# Altium project Проект_ЕТЗ.PrjPcb
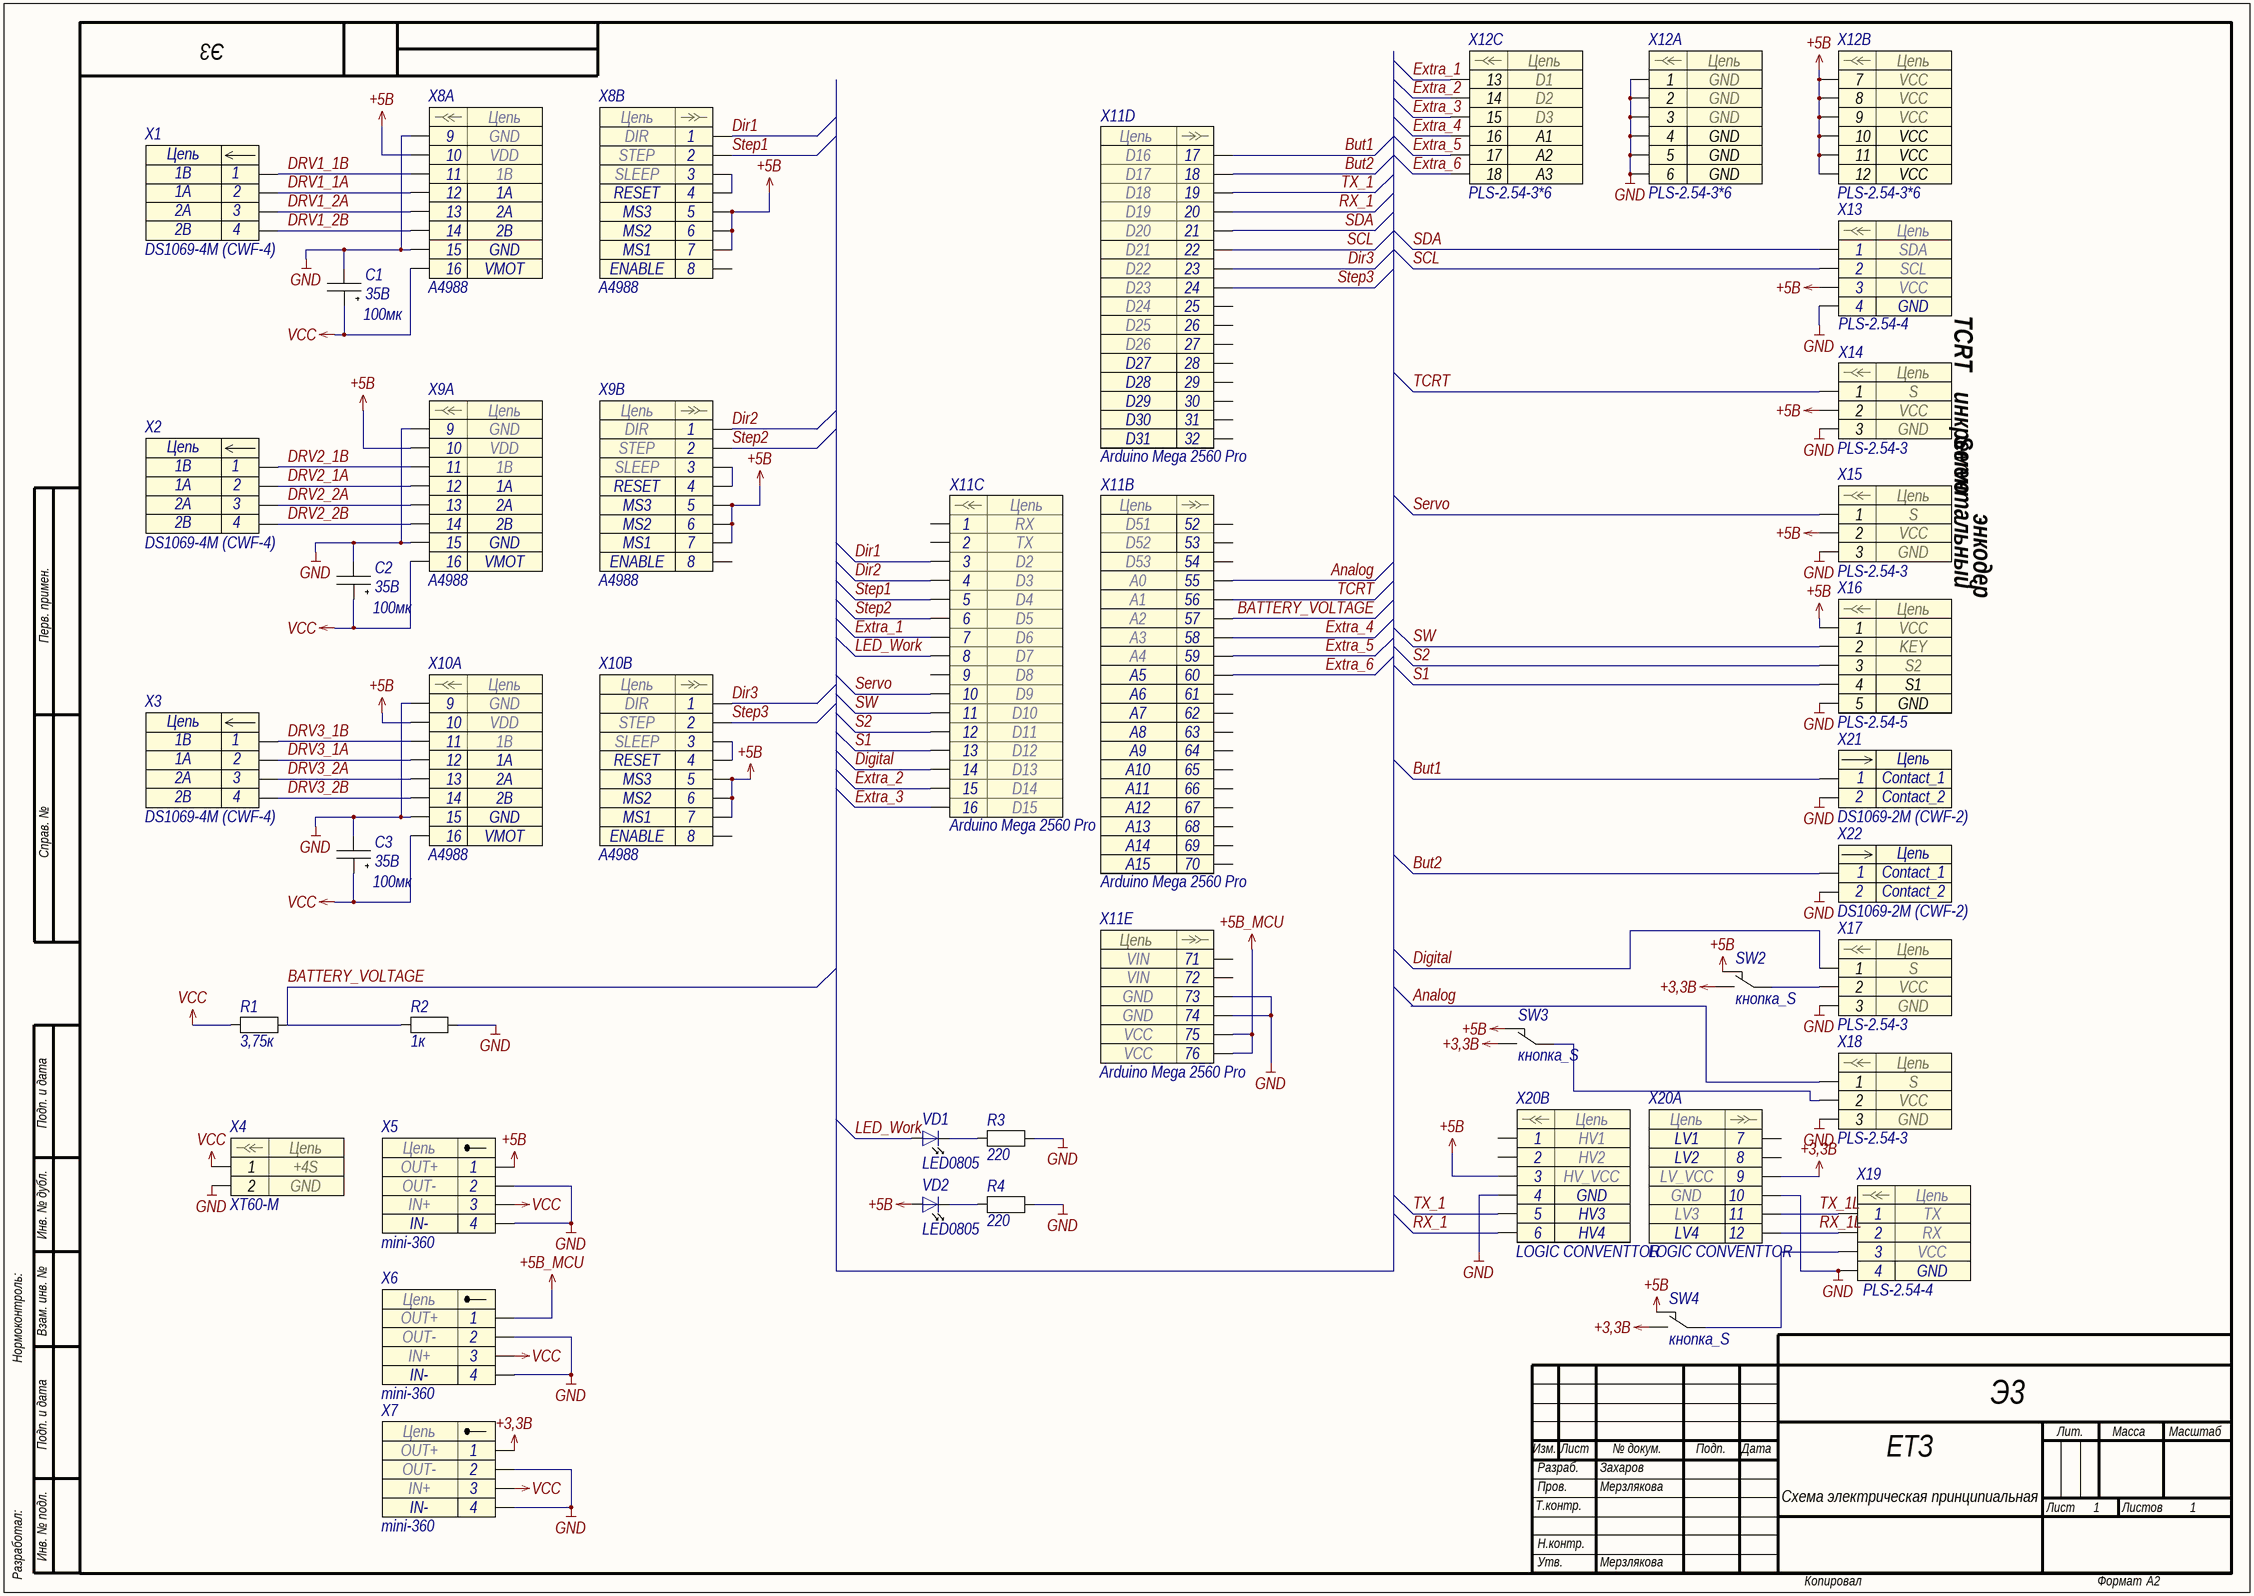
[diagram p0: Проект_ЕТЗ.SchDoc]
1 sheet, 34 parts. Net scope: global (net labels, ports and power ports of the same name join across sheets).
Board file: Проект_ЕТЗ.PcbDoc

## Sheet Проект_ЕТЗ.SchDoc: ЕТЗ
size 594 x 420 mm; check: Мерзлякова; PageSetup: Record=PageOptions|CenterHorizontal=True|CenterVertical=True|PrintScale=0.94|XCorrection=1.00|YCorrection=1.00|PrintKind=1|BorderSize=5000000|LeftOffset=0|BottomOffset=0|Orientation=1|PaperLength=1000|PaperWidth=1000|Scale=100|PaperSource=7|PrintQuality=-4|MediaType=1|DitherType=10|PaperKind=A4|PrintScaleMode=1; DecimalNumber: Децимальный номер; HeadOfSector: Нач. сектора; MainDevice: Перв.примен.; Name: Наименование; ApprovedBy: Мерзлякова; CheckedBy: Мерзлякова; DrawnBy: Захаров; DocumentNumber: Э3; SheetNumber: 1; SheetTotal: 1; title_line_1: ЕТЗ; document_type: Схема электрическая принципиальная

### Parts
C1  voltage: 35В  nominal: 100мк  [SK050M0100B3F-0811-up]  (hidden comment: am)
C2  voltage: 35В  nominal: 100мк  [SK050M0100B3F-0811-up]  (hidden comment: am)
C3  voltage: 35В  nominal: 100мк  [SK050M0100B3F-0811-up]  (hidden comment: am)
R1  3,75к  [Resistor0805]
R2  1к  [Resistor0805]
R3  220  [Resistor0805]
R4  220  [Resistor0805]
SW2  кнопка_S  [SS-12D00G3]
SW3  кнопка_S  [SS-12D00G3]
SW4  кнопка_S  [SS-12D00G3]
VD1  LED0805  [LED0805]
VD2  LED0805  [LED0805]
X1  DS1069-4M (CWF-4)  [CWF-4]
X2  DS1069-4M (CWF-4)  [CWF-4]
X3  DS1069-4M (CWF-4)  [CWF-4]
X4  XT60-M  [AMASS_XT60-M]
X5  mini-360  [mini360]
X6  mini-360  [mini360]
X7  mini-360  [mini360]
X8  A4988  [A4988]  (parts A,B of 2)
X9  A4988  [A4988]  (parts A,B of 2)
X10  A4988  [A4988]  (parts A,B of 2)
X11  Arduino Mega 2560 Pro  [PBD38]  (parts B,C,D,E of 5)
X12  PLS-2.54-3*6  [PLS-2.54-3*6]  (parts A,B,C of 3)
X13  PLS-2.54-4  [oled 128x64 0.96inch]
X14  PLS-2.54-3  [PLS-2.54-3]
X15  PLS-2.54-3  [PLS-2.54-3]
X16  PLS-2.54-5  [KY-040]
X17  PLS-2.54-3  [PLS-2.54-3]
X18  PLS-2.54-3  [PLS-2.54-3]
X19  PLS-2.54-4  [PLS-2.54-4]
X20  LOGIC CONVENTTOR  [LOGIC CONVENTOR]  (parts A,B of 2)
X21  DS1069-2M (CWF-2)  [CWF-2]
X22  DS1069-2M (CWF-2)  [CWF-2]

### Nets
+3,3В: SW2.1 SW3.1 SW4.1 X7.1 X20.9
+5В: SW2.3 SW3.3 SW4.3 VD2.2 X5.1 X8.5 X8.6 X8.7 X8.10 X9.5 X9.6 X9.7 X9.10 X10.5 X10.6 X10.7 X10.10 X12.7 X12.8 X12.9 X12.10 X12.11 X12.12 X13.3 X14.2 X15.2 X16.1 X20.3
+5В_MCU: X6.1 X11.75 X11.76
GND: C1.1 C2.1 C3.1 R2.2 R3.2 R4.2 X4.2 X5.2 X5.4 X6.2 X6.4 X7.2 X7.4 X8.9 X8.15 X9.9 X9.15 X10.9 X10.15 X11.73 X11.74 X12.1 X12.2 X12.3 X12.4 X12.5 X12.6 X13.4 X14.3 X15.3 X16.5 X17.3 X18.3 X19.4 X20.4 X20.10 X21.2 X22.2
VCC: C1.2 C2.2 C3.2 R1.1 X4.1 X5.3 X6.3 X7.3 X8.16 X9.16 X10.16
Analog: X11.55 X18.1
BATTERY_VOLTAGE: R1.2 R2.1 X11.57
But1: X11.17 X21.1
But2: X11.18 X22.1
Digital: X11.14 X17.1
Dir1: X8.1 X11.3
Dir2: X9.1 X11.4
Dir3: X10.1 X11.23
DRV1_1A: X1.2 X8.12
DRV1_1B: X1.1 X8.11
DRV1_2A: X1.3 X8.13
DRV1_2B: X1.4 X8.14
DRV2_1A: X2.2 X9.12
DRV2_1B: X2.1 X9.11
DRV2_2A: X2.3 X9.13
DRV2_2B: X2.4 X9.14
DRV3_1A: X3.2 X10.12
DRV3_1B: X3.1 X10.11
DRV3_2A: X3.3 X10.13
DRV3_2B: X3.4 X10.14
Extra_1: X11.7 X12.13
Extra_2: X11.15 X12.14
Extra_3: X11.16 X12.15
Extra_4: X11.58 X12.16
Extra_5: X11.59 X12.17
Extra_6: X11.60 X12.18
LED_Work: VD1.2 X11.8
RX_1: X11.20 X20.6
RX_1L: X19.2 X20.12
S1: X11.13 X16.4
S2: X11.12 X16.3
SCL: X11.22 X13.2
SDA: X11.21 X13.1
Servo: X11.10 X15.1
Step1: X8.2 X11.5
Step2: X9.2 X11.6
Step3: X10.2 X11.24
SW: X11.11 X16.2
TCRT: X11.56 X14.1
TX_1: X11.19 X20.5
TX_1L: X19.1 X20.11
NetR3_1: R3.1 VD1.1
NetR4_1: R4.1 VD2.1
NetSW2_2: SW2.2 X17.2
NetSW3_2: SW3.2 X18.2
NetSW4_2: SW4.2 X19.3
NetX8_3: X8.3 X8.4
NetX9_3: X9.3 X9.4
NetX10_3: X10.3 X10.4

Not connected (* = marked no-connect by the designer): X8 8; X9 8; X10 8; X11 1 2 9 25 26 27 28 29 30 31 32 52 53 54 61 62 63 64 65 66 67 68 69 70 71 72; X20 1 2 7 8

### Notes on the sheet
- TCRT
- Servo
- инкрементальный
- энкодер
- Перв. примен.
- Справ. №
- Подп. и дата
- Инв. № дубл.
- Нормоконтроль:
- Взам. инв. №
- Изм.
- Лист
- № докум.
- Подп.
- Дата
- Лит.
- Масса
- Масштаб
- Т.контр.
- Пров.
- Разраб.
- Листов
- Разработал:
- Инв. № подл.
- Н.контр.
- Утв.
- Копировал
- Формат
- А2
- (in symbol A4988, part A) Цепь; GND; VDD; 1B; 1A; 2A; 2B; VMOT
- (in symbol A4988, part B) Цепь; DIR; STEP; SLEEP; RESET; MS3; MS2; MS1; ENABLE
- (in symbol Arduino Mega 2560 Pro, part B) Цепь; D51; D52; D53; A0; A1; A2; A3; A4; A5; A6; A7; A8; A9; A10; A11; A12; A13; A14; A15
- (in symbol Arduino Mega 2560 Pro, part C) Цепь; RX; TX; D2; D3; D4; D5; D6; D7; D8; D9; D10; D11; D12; D13; D14; D15
- (in symbol Arduino Mega 2560 Pro, part D) Цепь; D16; D17; D18; D19; D20; D21; D22; D23; D24; D25; D26; D27; D28; D29; D30; D31
- (in symbol Arduino Mega 2560 Pro, part E) Цепь; VIN; GND; VCC
- (in symbol CWF-2) Цепь
- (in symbol CWF-4) Цепь
- (in symbol Ky-040) Цепь; VCC; KEY; S2; S1; GND
- (in symbol LOGIC CONVENTTOR, part A) Цепь; LV1; LV2; LV_VCC; GND; LV3; LV4
- (in symbol LOGIC CONVENTTOR, part B) Цепь; HV1; HV2; HV_VCC; GND; HV3; HV4
- (in symbol mini360) Цепь; OUT+; OUT-; IN+; IN-
- (in symbol PLS-2.54-3) Цепь
- (in symbol PLS-2.54-3*6, part A) Цепь
- (in symbol PLS-2.54-3*6, part B) Цепь
- (in symbol PLS-2.54-3*6, part C) Цепь
- (in symbol PLS-2.54-4) Цепь
- (in symbol XT60-M) Цепь

### Library data of the parts
C1-C3 = CAPATION+470мк35В: nam: конденсатор
R1-R4 = RESISTOR: nam: резистор
SW2-SW4 = BT992895: крутые переключатели с бимов; nam: кнопка_S
X1-X3 = CWF-4: Разъем - 4 конт. прямая вилка на плату; Contact_1: 1B; Contact_2: 1A; Contact_3: 2A; Contact_4: 2B; Name: DS1069-4M (CWF-4)
X4 = XT60-M: Plug; DC supply; XT60; male; PIN: 2; for cable; soldered; 30A; 500V; MF: AMASS; Contact_1: +4S; Contact_2: GND; SnapEDA_Link: https://www.snapeda.com/parts/XT60-M/AMASS/view-part/?ref=snap; Package: Package; Value: *; MP: XT60-M; Check_prices: https://www.snapeda.com/parts/XT60-M/AMASS/view-part/?ref=eda
X5-X7 = mini360: стаб 18 на 12 мм
X12 = PLS-2.54-3*6: Contact_1: GND; Contact_7: VCC; Contact_13: D1; Contact_14: D2; Contact_15: D3; Contact_16: A1; Contact_17: A2; Contact_18: A3; Contact_2: GND; Contact_3: GND; Contact_4: GND; Contact_5: GND; Contact_6: GND; Contact_8: VCC; Contact_9: VCC; Contact_10: VCC; Contact_11: VCC; Contact_12: VCC
X13 = PLS-2.54-4: Contact_1: SDA; Contact_2: SCL; Contact_3: VCC; Contact_4: GND
X14 X15 X17 X18 = PLS-2.54-3: nam: для датчиков; Contact_1: S; Contact_2: VCC; Contact_3: GND
X16 = Ky-040
X19 = PLS-2.54-4: Contact_1: TX; Contact_2: RX; Contact_3: VCC; Contact_4: GND
X21 X22 = CWF-2: Разъем - 2 конт. прямая вилка на плату; Contact_1: Contact_1; Contact_2: Contact_2; Name: DS1069-2M (CWF-2)
X11 = Arduino Mega 2560 Pro: nam: Arduino Mega 2560 Pro; Parameter 1: *